# EAGLE design R401C (EAGLE 4.11)
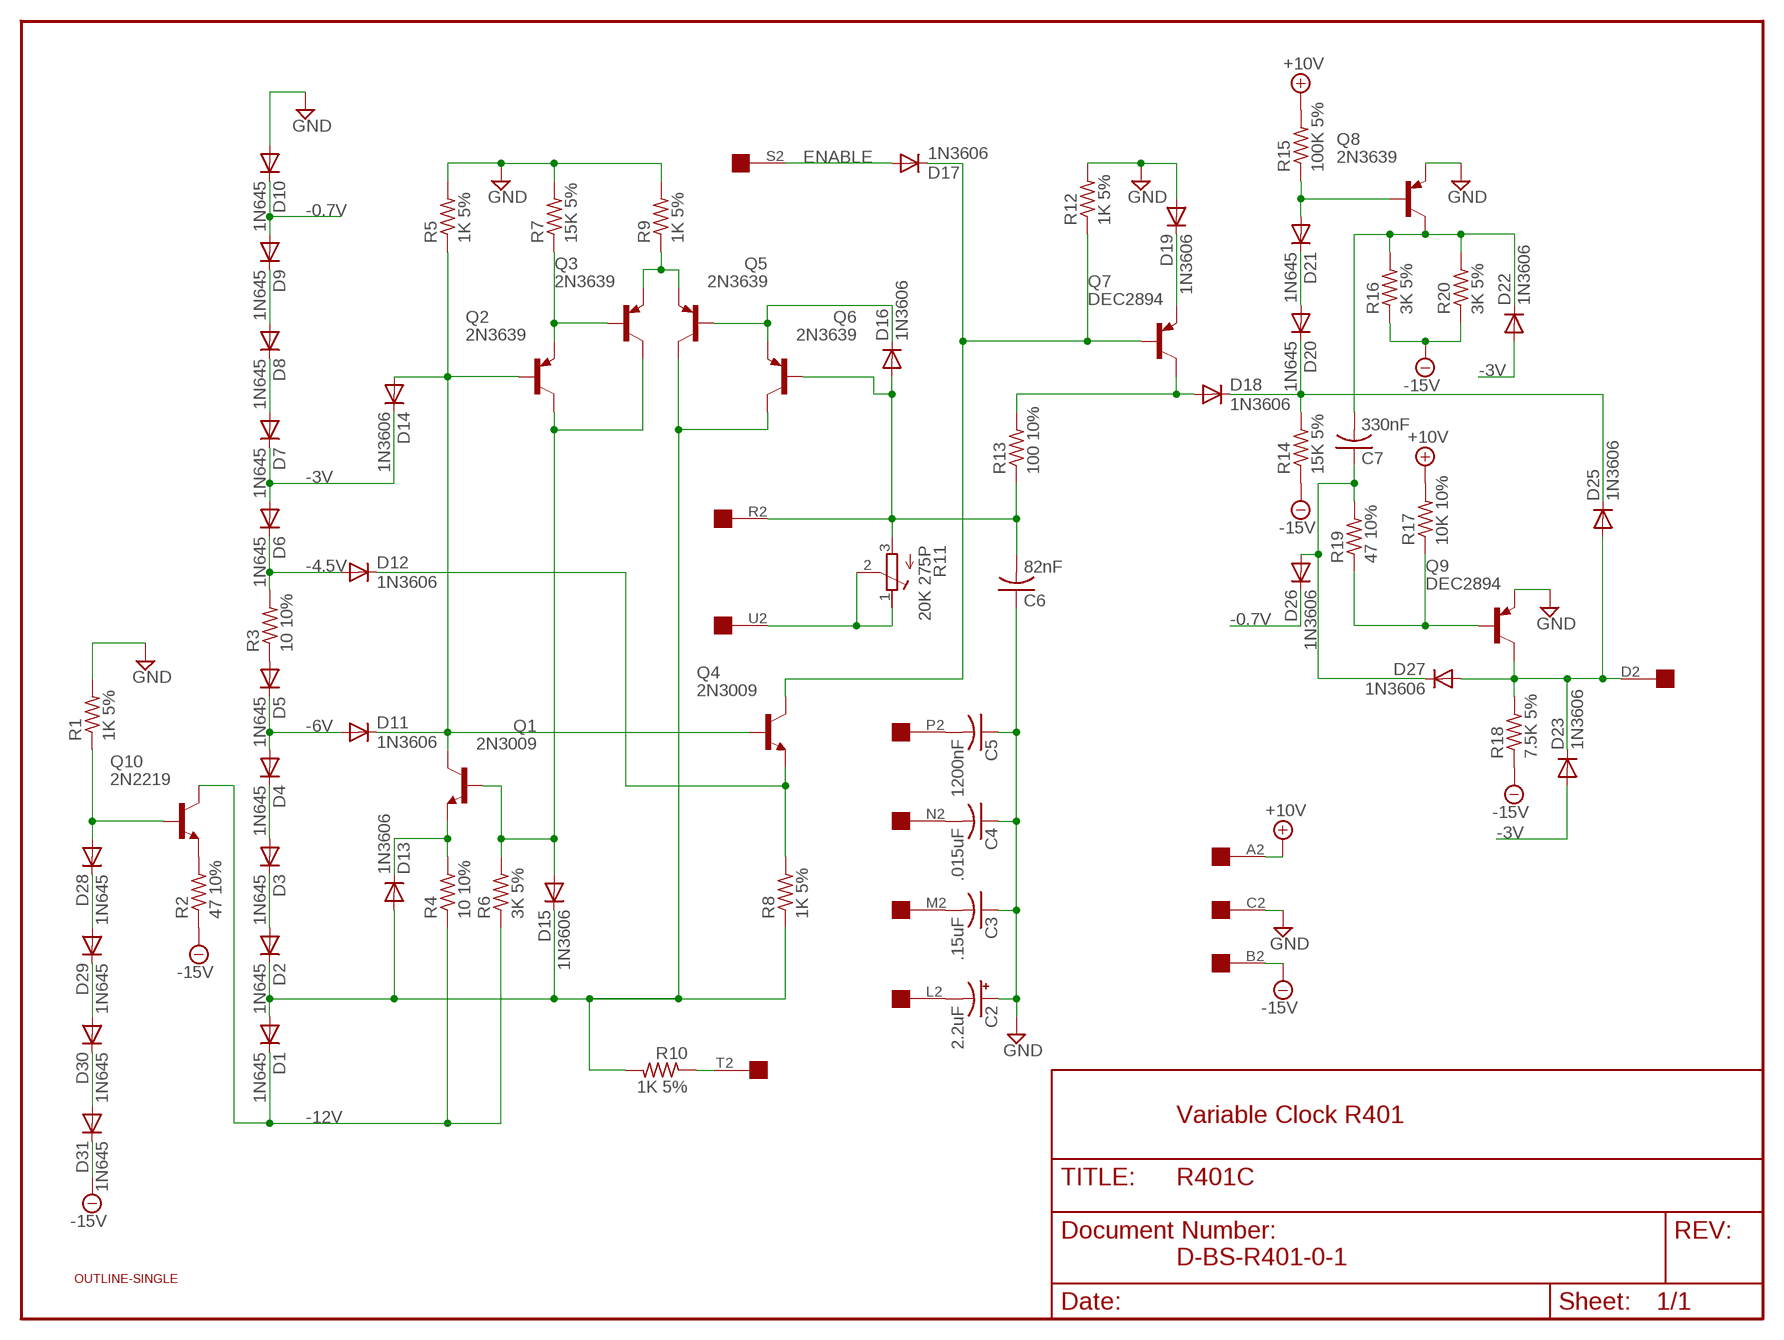
[diagram p0: schematic, sheet 1]

## Parts
C2  2.2uF  CPOL-USE12-4AXIAL  [E12-4]
C3  .15uF  C-US275-093X316  [C275-093X316]
C4  .015uF  C-US150-054X183  [C150-054X183]
C5  1200nF  C-US102-043X133  [C102-043X133]
C6  82nF  C-US150-054X183  [C150-054X183]
C7  330nF  C-US150-054X183  [C150-054X183]
D1  1N645  1N4148  [DO35-10]
D2  1N645  1N4148  [DO35-10]
D3  1N645  1N4148  [DO35-10]
D4  1N645  1N4148  [DO35-10]
D5  1N645  1N4148  [DO35-10]
D6  1N645  1N4148  [DO35-10]
D7  1N645  1N4148  [DO35-10]
D8  1N645  1N4148  [DO35-10]
D9  1N645  1N4148  [DO35-10]
D10  1N645  1N4148  [DO35-10]
D11  1N3606  1N4148  [DO35-10]
D12  1N3606  1N4148  [DO35-10]
D13  1N3606  1N4148  [DO35-10]
D14  1N3606  1N4148  [DO35-10]
D15  1N3606  1N4148  [DO35-10]
D16  1N3606  1N4148  [DO35-10]
D17  1N3606  1N4148  [DO35-10]
D18  1N3606  1N4148  [DO35-10]
D19  1N3606  1N4148  [DO35-10]
D20  1N645  1N4148  [DO35-10]
D21  1N645  1N4148  [DO35-10]
D22  1N3606  1N4148  [DO35-10]
D23  1N3606  1N4148  [DO35-10]
D25  1N3606  1N4148  [DO35-10]
D26  1N3606  1N4148  [DO35-10]
D27  1N3606  1N4148  [DO35-10]
D28  1N645  1N4148  [DO35-10]
D29  1N645  1N4148  [DO35-10]
D30  1N645  1N4148  [DO35-10]
D31  1N645  1N4148  [DO35-10]
Q1  2N3009  2N2102  [TO5]
Q2  2N3639  2N2904  [TO39]
Q3  2N3639  2N2904  [TO39]
Q4  2N3009  2N2102  [TO5]
Q5  2N3639  2N2904  [TO39]
Q6  2N3639  2N2904  [TO39]
Q7  DEC2894  2N2904  [TO39]
Q8  2N3639  2N2904  [TO39]
Q9  DEC2894  2N2904  [TO39]
Q10  2N2219  2N2102  [TO5]
R1  1K 5%  R-US_0207/10  [0207/10]
R2  47 10%  R-US_0207/10  [0207/10]
R3  10 10%  R-US_0207/10  [0207/10]
R4  10 10%  R-US_0207/10  [0207/10]
R5  1K 5%  R-US_0207/10  [0207/10]
R6  3K 5%  R-US_0207/10  [0207/10]
R7  15K 5%  R-US_0207/10  [0207/10]
R8  1K 5%  R-US_0207/10  [0207/10]
R9  1K 5%  R-US_0207/10  [0207/10]
R10  1K 5%  R-US_0207/10  [0207/10]
R11  20K 275P  275P  [3006Y]
R12  1K 5%  R-US_0207/10  [0207/10]
R13  100 10%  R-US_0207/10  [0207/10]
R14  15K 5%  R-US_0207/10  [0207/10]
R15  100K 5%  R-US_0207/10  [0207/10]
R16  3K 5%  R-US_0207/10  [0207/10]
R17  10K 10%  R-US_0207/10  [0207/10]
R18  7.5K 5%  R-US_0207/10  [0207/10]
R19  47 10%  R-US_0207/10  [0207/10]
R20  3K 5%  R-US_0207/10  [0207/10]
U$1  OUTLINE-SINGLE  [SINGLE]
U$2  EDGE-1  [EDGE-CON1]

## Nets
+10V [Supply]: R15.2 R17.2 U$2.A2
-0.7V [Supply]: D9.A D10.C D26.C
-3V [Supply]: D6.A D7.C D14.C D22.A D23.A
-4.5V [Supply]: D6.C D12.A R3.2
-6V [Supply]: D4.A D5.C D11.A
-12V [Supply]: D1.C Q10.3(C) R4.1 R6.1
-15V [Supply]: D31.C R2.1 R14.1 R16.1 R18.1 R20.1 U$2.B2
ENABLE: D17.A U$2.S2
GND [Supply]: C2.+ C3.1 C4.1 C5.1 C6.1 D10.A D19.A Q8.1(E) Q9.1(E) R1.2 R5.2 R7.2 R9.2 R12.2 U$2.C2
N$1: D28.C D29.A
N$2: D30.C D31.A
N$3: D29.C D30.A
N$4: D28.A Q10.2(B) R1.1
N$5: Q10.1(E) R2.2
N$6: D5.A R3.1
N$7: D11.C D14.A Q1.3(C) Q2.2(B) Q4.2(B) R5.1
N$8 [Supply]: D8.A D9.C
N$9 [Supply]: D7.A D8.C
N$10: D13.C Q1.1(E) R4.2
N$11: D15.A Q1.2(B) Q2.3(C) Q3.3(C) R6.2
N$12 [Supply]: D1.A D2.C D13.A D15.C Q5.3(C) Q6.3(C) R8.1 R10.2
N$13 [Supply]: D2.A D3.C
N$14 [Supply]: D3.A D4.C
N$15: Q2.1(E) Q3.2(B) R7.1
N$16: Q3.1(E) Q5.1(E) R9.1
N$17: D12.C Q4.1(E) R8.2
N$18: D16.C Q5.2(B) Q6.1(E)
N$19: C6.2 D16.A Q6.2(B) R11.3(E) R13.1 U$2.R2
N$20: R11.1(A) R11.2(S) U$2.U2
N$21: D17.C Q4.3(C) Q7.2(B) R12.1
N$22 [Supply]: D19.C Q7.1(E)
N$23: D18.A Q7.3(C) R13.2
N$24: C4.2 U$2.N2
N$25: D23.C D25.A D27.A Q9.3(C) R18.2 U$2.D2
N$26: C3.2 U$2.M2
N$27: C2.- U$2.L2
N$28: C5.2 U$2.P2
N$29: D21.A Q8.2(B) R15.1
N$30: D20.A D21.C
N$32: C7.2 D22.C Q8.3(C) R16.2 R20.2
N$33: D18.C D20.C D25.C R14.2
N$34: Q9.2(B) R17.1 R19.1
N$35: C7.1 D26.A D27.C R19.2
N$37: R10.1 U$2.T2
Unconnected: U$2.E2 U$2.F2 U$2.H2 U$2.J2 U$2.K2 U$2.V2

## Notes on the sheet
- Variable Clock R401
- D-BS-R401-0-1

## Library data of the parts
C2 = dec-con:CPOL-USE12-4AXIAL: 0.5" veresion of an electrolytic
C3-C7 = rcl:C-US: CAPACITOR, American symbol
D1-D23 D25-D31 = diode:1N4148: DIODE high speed (Philips)
Q1 Q4 Q10 = transistor-npn:2N2102: NPN Transistor
Q2 Q3 Q5-Q9 = transistor-pnp:2N2904*: PNP Transistror
R1-R10 R12-R20 = rcl:R-US_: RESISTOR, American symbol
R11 = dec-con:275P: Trimpot with 275P (3006Y) footprint.
U$1 = dec-con:OUTLINE-*: Board outlines for DEC boards.
U$2 = dec-con:EDGE-1: Single-Sided DEC Edge Connector -- (side 2)

## Net classes
1 Supply: width 0.813 mm

## Board
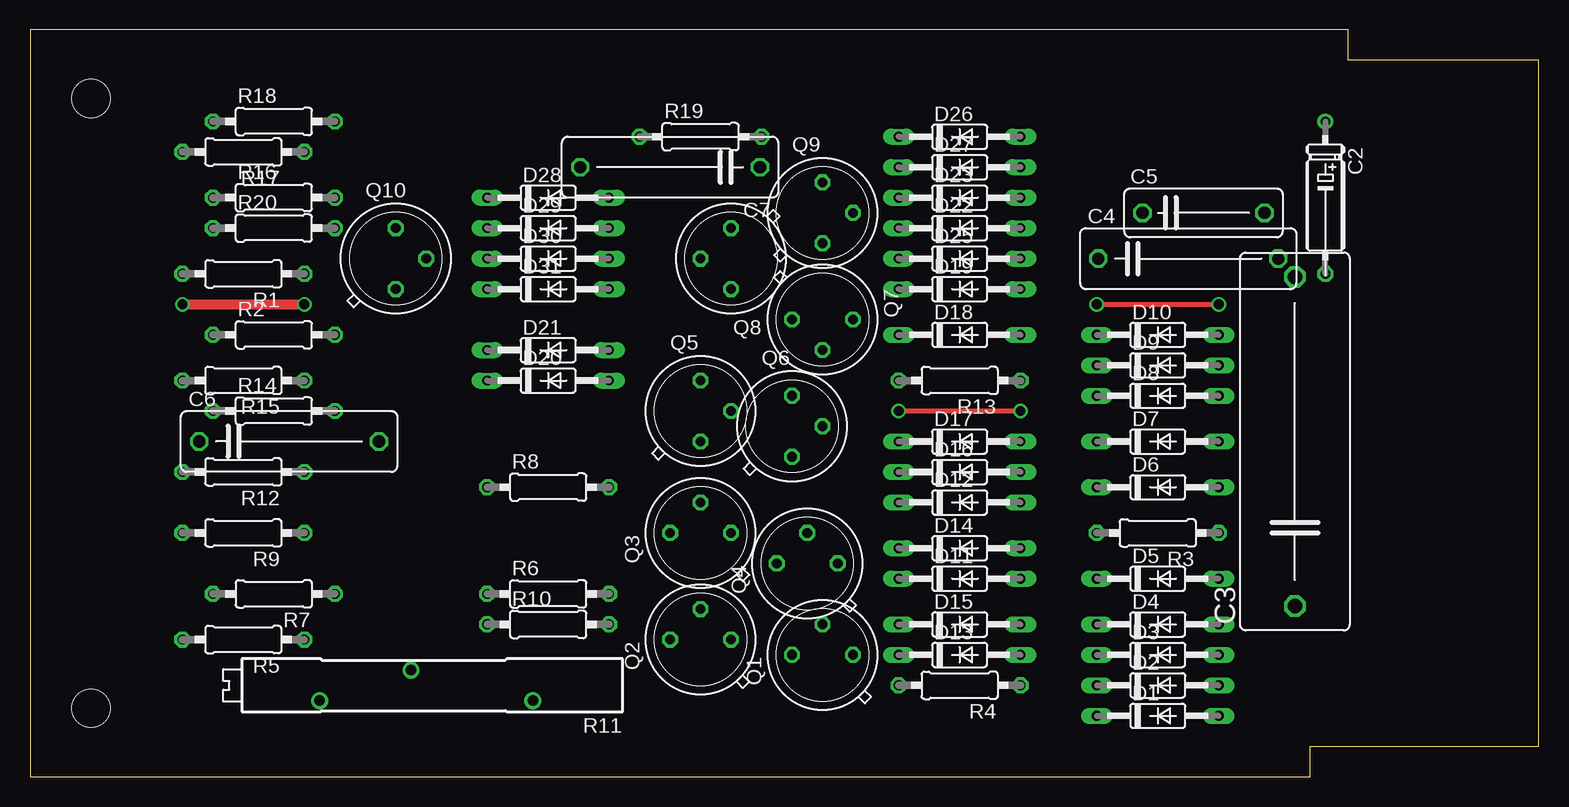
[diagram p1: board, top side]
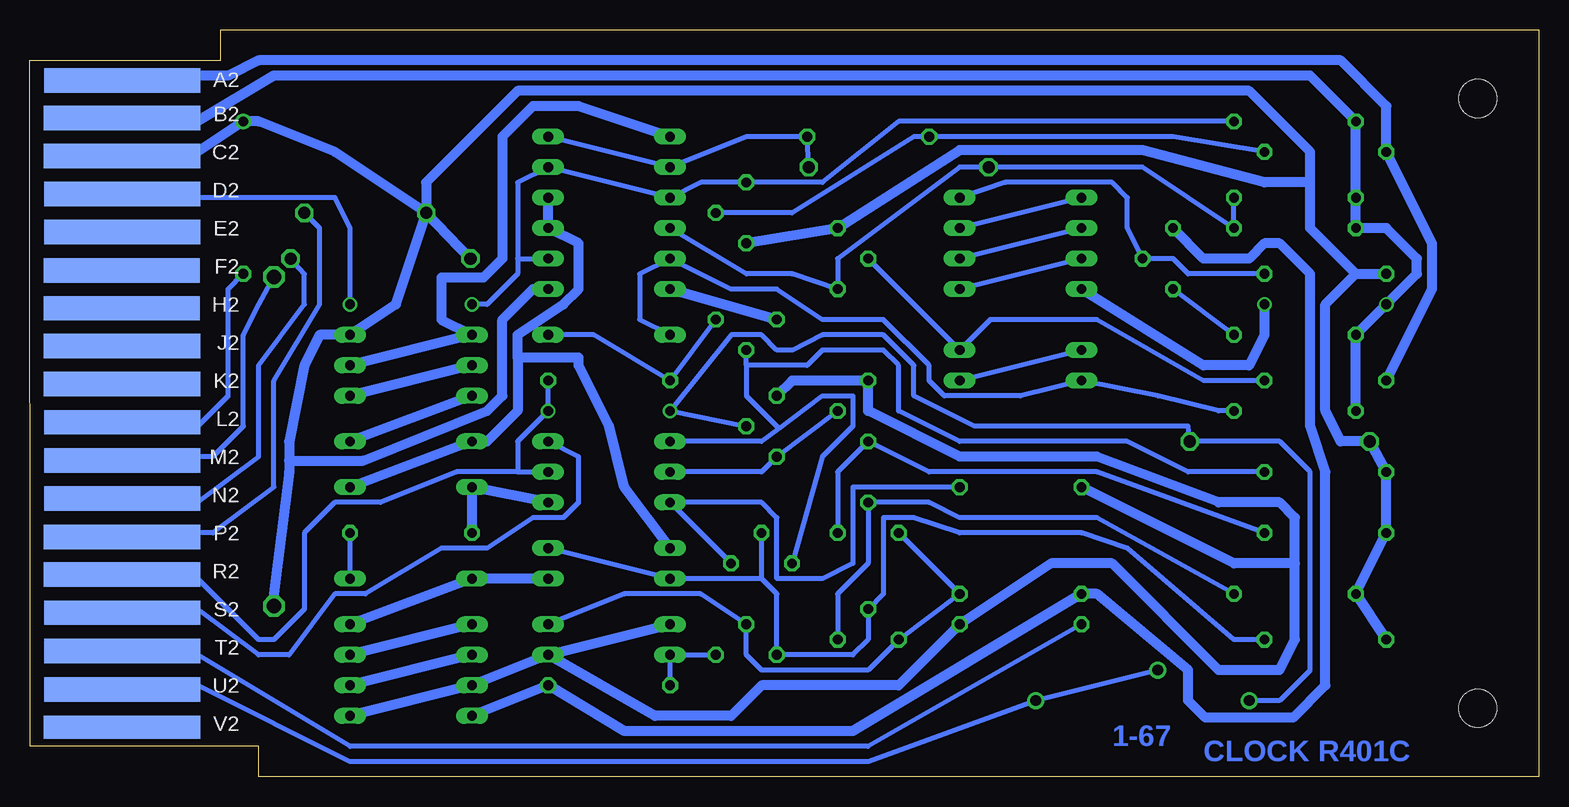
[diagram p2: board, bottom side, seen from below]

Size 125.73 x 62.23 mm. Coordinates in mm from the lower left corner, seen from the top.
Copper layers (1+16): Top 0.035mm / dielectric 1.5mm / Bottom 0.035mm
Design rules "16mils": minimum track width 16mil, minimum drill 32mil, track to track 15mil, track to pad 10mil, pad to pad 10mil, via to via 10mil, smd to smd 10mil, copper to edge 25mil, drill to drill 10mil, minimum pad ring 10mil, minimum via ring 8mil, stop-mask expansion 0mil, vias tented up to drill 0mil, thermal gap 10mil

### Footprints (pad centres in the part's own frame; a part is rotated, then mirrored left to right if it is on the bottom)
E12-4 = drill 0.813 round: + -7.62,0 | drill 0.813 octagon: - 5.08,0
C275-093X316 = drill 1.194 octagon: 1 -13.716,0; 2 13.716,0
C150-054X183 = drill 1.016 octagon: 1 -7.493,0; 2 7.493,0
C102-043X133 = drill 1.016 octagon: 1 -5.08,0; 2 5.08,0
DO35-10 = drill 0.813 long: A 5.08,0; C -5.08,0
TO5 = drill 0.813 octagon: 1 0,-2.54; 2 2.54,0; 3 0,2.54
TO39 = drill 0.813 octagon: 1 0,-2.54; 2 2.54,0; 3 0,2.54
0207/10 = drill 0.813 octagon: 1 -5.08,0; 2 5.08,0
3006Y = drill 0.9 round: 1 -8.89,1.27; 2 1.27,-1.27; 3 8.89,1.27
SINGLE = hole 3.175: 120.65,56.515; 120.65,5.715
EDGE-CON1 = smd 13.017 x 2.032 bottom: A2 7.69,4.194; B2 7.668,7.328; C2 7.668,10.49; D2 7.693,13.665; E2 7.693,16.84; F2 7.642,20.041; H2 7.642,23.19; J2 7.668,26.34; K2 7.668,29.515; L2 7.693,32.69; M2 7.693,35.89; N2 7.693,39.04; P2 7.668,42.24; R2 7.668,45.39; S2 7.693,48.565; T2 7.693,51.74; U2 7.693,54.966 | smd 13.017 x 1.905 bottom: V2 7.668,58.102

### Placement (x,y rotation side)
C2  107.95,46.99 270 top
C3  105.41,27.94 90 top
C4  96.52,43.18 0 top
C5  1200pF  [C102-043X133]  97.79,46.99 0 top
C6  82pF  [C150-054X183]  21.59,27.94 0 top
C7  330pF  [C150-054X183]  53.34,50.8 180 top
D1  93.98,5.08 0 top
D2  93.98,7.62 0 top
D3  93.98,10.16 0 top
D4  93.98,12.7 0 top
D5  93.98,16.51 0 top
D6  93.98,24.13 0 top
D7  93.98,27.94 0 top
D8  93.98,31.75 0 top
D9  93.98,34.29 0 top
D10  93.98,36.83 0 top
D11  77.47,16.51 0 top
D12  77.47,22.86 0 top
D13  77.47,10.16 0 top
D14  77.47,19.05 0 top
D15  77.47,12.7 0 top
D16  77.47,25.4 0 top
D17  77.47,27.94 0 top
D18  77.47,36.83 0 top
D19  77.47,40.64 0 top
D20  43.18,33.02 0 top
D21  43.18,35.56 0 top
D22  77.47,45.72 0 top
D23  77.47,48.26 0 top
D25  77.47,43.18 0 top
D26  77.47,53.34 0 top
D27  77.47,50.8 0 top
D28  43.18,48.26 0 top
D29  43.18,45.72 0 top
D30  43.18,43.18 0 top
D31  43.18,40.64 0 top
Q1  66.04,10.16 90 top
Q2  55.88,11.43 90 top
Q3  55.88,20.32 90 top
Q4  64.77,17.78 90 top
Q5  55.88,30.48 0 top
Q6  63.5,29.21 0 top
Q7  66.04,38.1 270 top
Q8  58.42,43.18 180 top
Q9  66.04,46.99 0 top
Q10  30.48,43.18 0 top
R1  17.78,41.91 180 top
R2  20.32,36.83 0 top
R3  93.98,20.32 180 top
R4  77.47,7.62 180 top
R5  17.78,11.43 180 top
R6  43.18,15.24 0 top
R7  20.32,15.24 180 top
R8  43.18,24.13 0 top
R9  17.78,20.32 180 top
R10  43.18,12.7 0 top
R11  33.02,7.62 180 top
R12  17.78,25.4 180 top
R13  77.47,33.02 180 top
R14  20.32,30.48 0 top
R15  17.78,33.02 180 top
R16  20.32,48.26 0 top
R17  17.78,52.07 180 top
R18  20.32,54.61 0 top
R19  55.88,53.34 0 top
R20  20.32,45.72 0 top
U$1  125.73,62.23 180 top
U$2  125.73,62.23 180 top

### Tracks (layer width: path | path; a pad name or v marks a point on that pad's centre or on a via)
+10V
  Bottom 0.813: U$2.A2 116.84,58.42 109.22,58.42 106.68,59.69 16.51,59.69 12.7,55.88 R17.2 8.89,44.45 8.89,40.64 R15.2
-0.7V
  Bottom 0.813: D9.A D10.C 91.44,38.1 91.44,41.59 87.95,41.59 86.36,43.18 86.36,53.34 83.82,55.88 80.01,55.88 D26.C
-3V
  Bottom 0.813: D6.A D7.C 87.63,27.94 85.09,30.48 85.09,34.92 | D14.C 76.2,24.13 77.47,29.21 80.01,34.29 80.01,34.92 85.09,34.92 | 85.09,34.92 85.09,36.83 81.28,39.37 80.01,40.64 80.01,44.45 D22.A D23.A
-4.5V
  Bottom 0.813: D12.A D6.C R3.2
-6V
  Bottom 0.813: D4.A D5.C D11.A
-12V
  Bottom 0.813: D1.C R4.1 76.2,3.81 57.15,3.81 R6.1 36.83,15.24 29.21,8.89 29.21,6.35 27.78,4.92 20.48,4.92 17.78,7.62 17.78,25.4 19.05,29.21 19.05,41.91 21.59,44.45 22.86,44.45 24.13,43.18 27.94,43.18 Q10.3
-15V  (via drill 0.81)
  Top 0.813: v12.7,39.37 v22.86,39.37
  Bottom 0.813: U$2.B2 116.84,54.61 111.76,54.61 105.41,58.42 19.05,58.42 R18.1 R16.1 R20.1 12.7,45.72 10.16,43.18 10.16,41.91 v12.7,39.37 R2.1 R14.1 | D31.C 27.94,34.29 24.13,34.29 22.86,36.83 v22.86,39.37
ENABLE
  Bottom 0.406: U$2.S2 116.84,13.97 111.76,13.97 106.68,10.16 104.14,10.16 100.33,15.24 97.79,15.24 91.44,19.05 87.63,19.05 83.82,21.59 81.28,21.59 80.01,22.86 80.01,26.67 D17.A
GND
  Bottom 0.813: U$2.C2 116.84,52.07 111.76,52.07 C2.+ 106.68,54.61 100.33,52.07 C5.1 | C5.1 95.25,39.37 D10.A 101.6,36.83 102.87,34.29 104.14,27.94 104.14,26.35 | 104.14,26.35 104.14,25.4 105.41,15.24 C3.1 105.41,13.97 | 104.14,26.35 97.95,26.35 87.63,30.48 86.36,31.75 86.36,38.1 83.82,40.64 D19.A | C5.1 C4.1 | C5.1 92.71,49.53 85.09,57.15 24.13,57.15 19.05,52.07 19.05,49.53 | 19.05,49.53 19.05,45.72 15.24,41.91 | 15.24,41.91 R1.2 | Q9.1 Q8.1 48.26,52.23 33.02,52.23 22.86,49.53 19.05,49.53 | 15.24,41.91 17.78,39.37 17.78,30.48 16.51,27.94 C6.1 R12.2 R9.2 R7.2 R5.2
N$1
  Bottom 0.406: D28.C D29.A
N$2
  Bottom 0.406: D30.C D31.A
N$3
  Bottom 0.406: D29.C D30.A
N$4
  Bottom 0.406: R1.1 29.21,41.91 30.48,43.18 Q10.2 34.29,45.72 34.29,48.26 35.56,49.53 44.45,49.53 D28.A
N$5
  Bottom 0.406: R2.2 Q10.1
N$6
  Bottom 0.406: D5.A R3.1
N$7
  Bottom 0.406: 64.77,16.51 63.5,15.24 Q1.3 57.15,10.16 55.88,11.43 Q2.2 54.61,15.24 54.61,21.59 52.07,21.59 48.26,20.32 38.1,20.32 34.29,19.05 25.4,11.43 R5.1 | 64.77,16.51 Q4.2 | 64.77,16.51 D11.C D14.A
N$8
  Bottom 0.813: D9.C D8.A
N$9
  Bottom 0.813: D8.C D7.A
N$10
  Bottom 0.406: Q1.1 D13.C R4.2
N$11
  Bottom 0.406: D15.A 76.2,15.24 69.85,15.24 Q1.2 66.04,10.16 64.77,8.89 55.88,8.89 Q2.3 R6.2 Q3.3
N$12
  Bottom 0.813: Q6.3 62.23,33.02 Q5.3 55.88,30.48 48.26,26.67 36.83,26.67 26.67,22.86 21.59,22.86 20.32,21.59 20.32,17.78 | D13.A 73.66,5.08 67.31,5.08 64.77,7.62 53.34,7.62 R10.2 40.64,17.78 35.56,17.78 26.67,8.89 21.59,8.89 20.32,11.43 20.32,17.78 | 20.32,17.78 25.4,17.78 R8.1 | D13.A D2.C D1.A | D13.A D15.C
N$13
  Bottom 0.813: D3.C D2.A
N$14
  Bottom 0.813: D4.C D3.A
N$15
  Bottom 0.406: Q2.1 58.42,15.24 55.88,17.78 Q3.2 50.8,22.86 48.26,21.59 36.83,21.59 R7.1
N$16
  Bottom 0.406: Q3.1 58.42,25.4 Q5.1 50.8,25.4 36.83,25.4 R9.1
N$17
  Bottom 0.406: Q4.1 D12.C 64.77,22.86 63.5,21.59 63.5,16.51 59.69,16.51 57.15,17.78 57.15,24.13 R8.2
N$18
  Bottom 0.406: Q5.2 Q6.1 64.77,25.4 D16.C
N$19  (via drill 0.81)
  Top 0.406: v72.39,30.48 v82.55,30.48
  Bottom 0.406: R11.3 21.59,6.35 19.05,8.89 19.05,25.4 21.59,27.94 C6.2 29.21,29.21 46.99,29.21 52.07,31.75 52.07,34.29 54.61,36.83 59.69,36.83 62.23,35.56 63.5,35.56 64.77,36.83 67.31,36.83 v72.39,30.48 Q6.2 | U$2.R2 116.84,16.51 111.76,16.51 106.68,11.43 105.41,11.43 102.87,13.97 102.87,20.32 100.33,22.86 96.52,22.86 90.17,25.4 85.09,25.4 | 85.09,25.4 D16.A | 85.09,25.4 85.09,27.94 v82.55,30.48 R13.1
N$20
  Bottom 0.406: U$2.U2 116.84,7.26 116.84,7.62 111.76,7.62 99.06,1.27 55.88,1.27 R11.1 R11.2
N$21
  Bottom 0.406: D17.C 64.77,27.94 63.35,29.01 | 63.35,29.01 59.69,31.75 57.15,31.75 57.15,29.21 59.69,26.67 Q4.3 | 66.04,34.29 66.04,31.75 63.5,29.21 63.35,29.01 | 66.04,34.29 Q7.2 | R12.1 29.21,25.4 34.29,27.94 48.26,27.94 53.34,30.48 53.34,34.29 54.61,35.56 59.69,35.56 60.96,34.29 66.04,34.29
N$22
  Bottom 0.813: Q7.1 D19.C
N$23
  Bottom 0.406: Q7.3 R13.2 78.74,36.83 D18.A
N$24
  Bottom 0.406: U$2.N2 116.84,22.86 111.76,22.86 106.68,26.67 106.68,34.29 102.87,39.37 102.87,41.91 C4.2
N$25  (via drill 0.81)
  Top 0.406: v88.9,39.37 v99.06,39.37
  Bottom 0.406: U$2.D2 116.84,48.26 100.33,48.26 99.06,45.72 v99.06,39.37 | 85.09,43.18 85.09,41.91 87.63,39.37 v88.9,39.37 | 85.09,43.18 D25.A | 85.09,43.18 85.09,49.53 D27.A D23.C 69.85,49.53 Q9.3 59.69,49.53 53.34,54.61 R18.2
N$26
  Bottom 0.406: U$2.M2 116.84,26.67 110.49,26.67 107.95,29.21 107.95,36.83 106.68,39.37 C3.2 105.41,41.91
N$27
  Bottom 0.406: U$2.L2 116.84,29.21 111.76,29.21 109.22,31.75 109.22,40.64 C2.-
N$28
  Bottom 0.406: U$2.P2 116.84,20.32 110.49,20.32 105.41,24.13 105.41,33.02 101.6,39.37 101.6,45.72 C5.2
N$29
  Bottom 0.406: Q8.2 D21.A 45.72,38.1 36.83,38.1 27.94,33.02 R15.1
N$30
  Bottom 0.406: D21.C D20.A
N$32
  Bottom 0.406: R16.2 R20.2 33.02,50.8 C7.2 48.26,50.8 58.42,43.18 Q8.3 62.23,41.91 66.04,41.91 D22.C
N$33
  Bottom 0.406: D18.C 74.93,38.1 74.93,41.91 D25.C 67.31,40.64 63.5,40.64 59.69,38.1 54.61,38.1 50.8,34.29 50.8,33.02 49.53,31.75 43.18,31.75 D20.C 31.75,31.75 26.67,30.48 R14.2
N$34
  Bottom 0.406: Q9.2 62.23,46.99 52.07,53.34 R19.1 30.48,53.34 R17.1
N$35
  Bottom 0.406: D26.A D27.C 66.04,53.34 R19.2 C7.1
N$37
  Bottom 0.406: U$2.T2 116.84,10.16 111.76,10.16 99.06,2.54 55.88,2.54 R10.1

### Text on the board
Bottom: 1-67 | CLOCK R401C
200bmp: C:/Users/Vince/Documents/websvn/trunk/Eagle/projects/DEC/Rxxx/R401/R401Cbackf.bmp